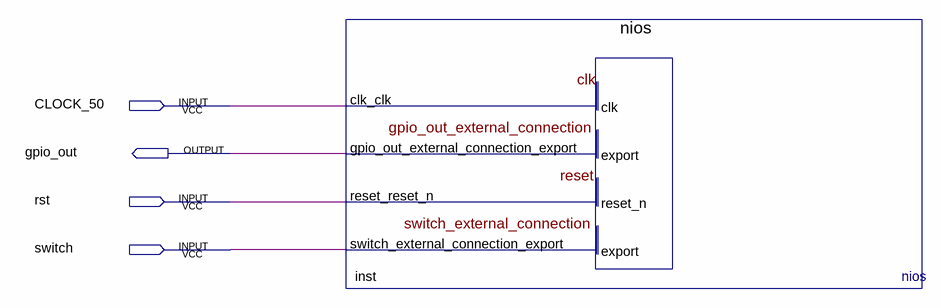
[diagram p0: schematic sheet]
// Quartus schematic FPGA1.bdf as structural Verilog: 1 symbols, 4 pins
module FPGA1 (
  input  CLOCK_50,
  input  rst,
  input  switch,
  output gpio_out
);

  nios inst (
    .clk_clk(CLOCK_50), .reset_reset_n(rst), .switch_external_connection_export(switch),
    .gpio_out_external_connection_export(gpio_out));
endmodule
